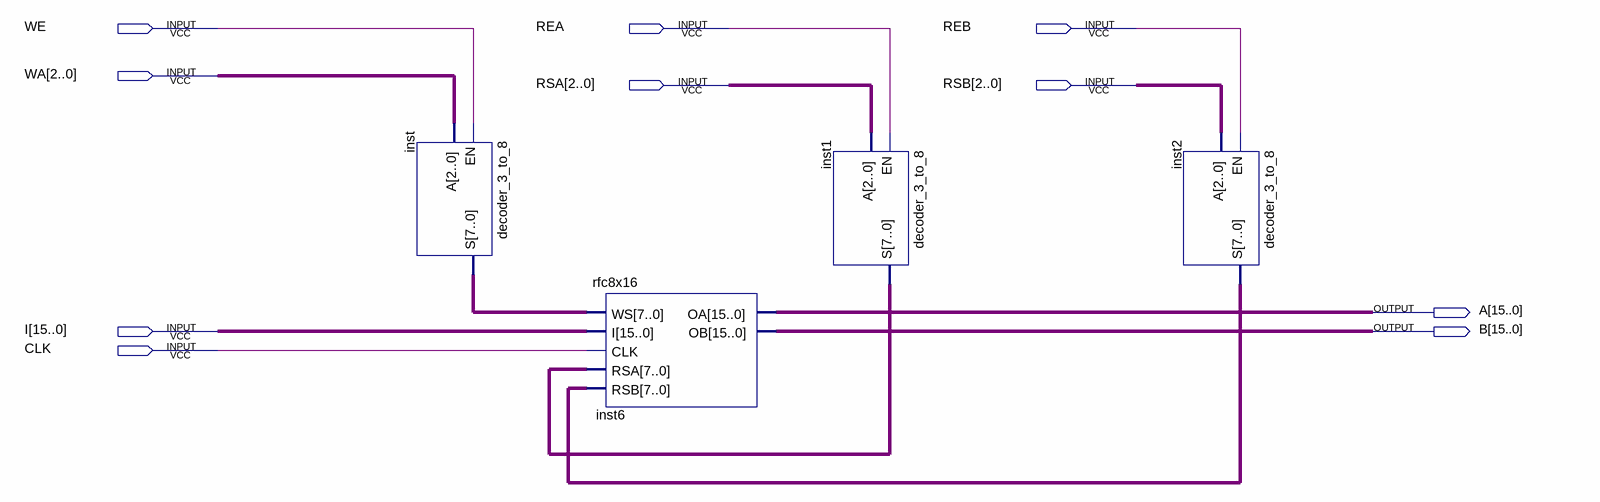
[diagram p0: schematic sheet]
// Quartus schematic register_file_complete.bdf as structural Verilog: 4 symbols, 10 pins
module register_file_complete (
  input  WE,
  input  REA,
  input  REB,
  input  [2:0] WA,
  input  [2:0] RSA,
  input  [2:0] RSB,
  input  [15:0] I,
  input  CLK,
  output [15:0] A,
  output [15:0] B
);

  wire [7:0] inst1_s, inst2_s, inst_s;

  decoder_3_to_8 inst (.EN(WE), .A(WA), .S(inst_s));
  rfc8x16 inst6 (.WS(inst_s), .I(I), .CLK(CLK), .RSA(inst1_s), .RSB(inst2_s), .OA(A), .OB(B));
  decoder_3_to_8 inst1 (.EN(REA), .A(RSA), .S(inst1_s));
  decoder_3_to_8 inst2 (.EN(REB), .A(RSB), .S(inst2_s));
endmodule
